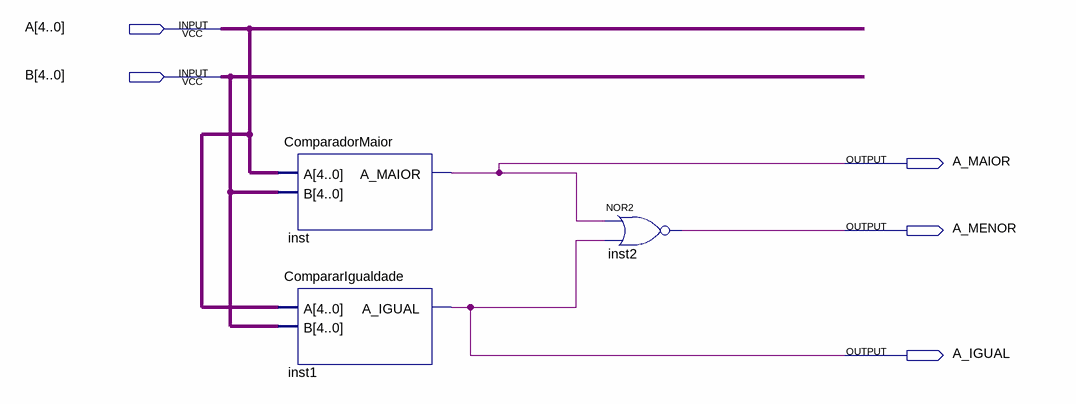
[diagram p0: schematic sheet]
// Quartus schematic ComparadorCompleto.bdf as structural Verilog: 3 symbols, 5 pins
module ComparadorCompleto (
  input  [4:0] A,
  input  [4:0] B,
  output A_MAIOR,
  output A_MENOR,
  output A_IGUAL
);

  ComparadorMaior inst (.A(A), .B(B), .A_MAIOR(A_MAIOR));
  CompararIgualdade inst1 (.A(A), .B(B), .A_IGUAL(A_IGUAL));
  nor inst2 (A_MENOR, A_MAIOR, A_IGUAL);
endmodule
